# EAGLE schematic 2022_Tennessee_Competition (EAGLE 9.6.2)
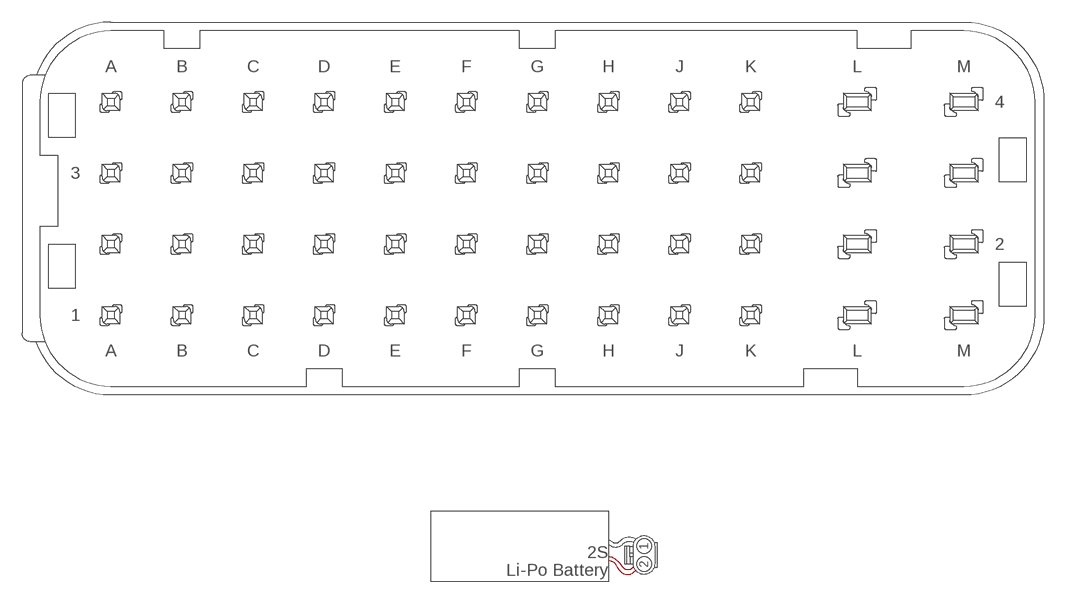
[diagram p0: schematic, sheet 1, part 1 of 2]
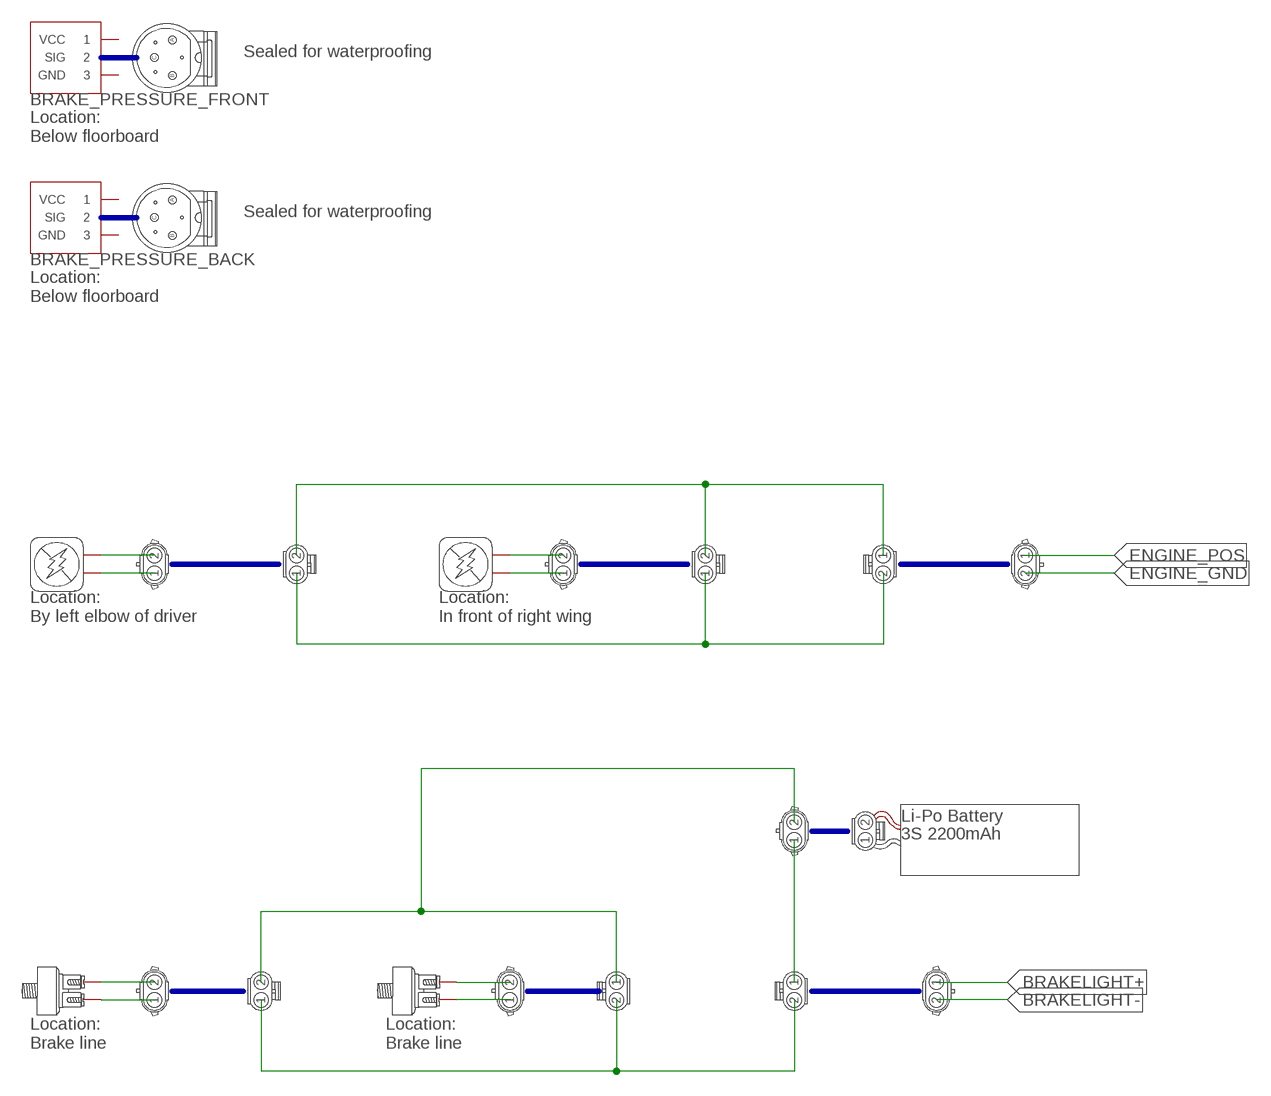
[diagram p1: schematic, sheet 1, part 2 of 2]

## Parts
BRAKE_PRESSURE_BACK  SENSOR_1X3  [PINS_3]
BRAKE_PRESSURE_FRONT  SENSOR_1X3  [PINS_3]
U$2  CMC_48PIN_PLUG_PCB  [PINS_49]
U$4  SKIDOO_KILLSWITCH  [PINS_3]
U$5  WEATHERPACK_1X2_MALE  [PINS_3]
U$6  WEATHERPACK_1X2_FEMALE  [PINS_3]
U$7  WEATHERPACK_1X2_MALE  [PINS_3]
U$8  WEATHERPACK_1X2_MALE  [PINS_3]
U$9  SKIDOO_KILLSWITCH  [PINS_3]
U$10  WEATHERPACK_1X2_FEMALE  [PINS_3]
U$11  WEATHERPACK_1X2_FEMALE  [PINS_3]
U$12  BRAKELIGHT_SWITCH_HYDRAULIC  [PINS_3]
U$13  WEATHERPACK_1X2_MALE  [PINS_3]
U$15  WEATHERPACK_1X2_FEMALE  [PINS_3]
U$16  WEATHERPACK_1X2_MALE  [PINS_3]
U$17  WEATHERPACK_1X2_MALE  [PINS_3]
U$18  BRAKELIGHT_SWITCH_HYDRAULIC  [PINS_3]
U$19  WEATHERPACK_1X2_FEMALE  [PINS_3]
U$20  WEATHERPACK_1X2_FEMALE  [PINS_3]
U$29  3S 2200mAh  LIPO_BATT  [PINS_200]
U$31  2S  LIPO_BATT  [PINS_200]
U$32  WEATHERPACK_1X2_MALE  [PINS_3]
U$47  METRIPACK_3PIN_FEMALE  [PINS_3]
U$48  METRIPACK_3PIN_FEMALE  [PINS_3]

## Nets
BRAKELIGHT+: U$16.P$2
BRAKELIGHT-: U$16.P$1
ENGINE_GND: U$7.P$1
ENGINE_POS: U$7.P$2
N$1: U$4.P$2 U$5.P$1
N$2: U$4.P$1 U$5.P$2
N$3: U$8.P$1 U$9.P$2
N$4: U$8.P$2 U$9.P$1
N$5: U$12.P$2 U$17.P$2
N$6: U$12.P$1 U$17.P$1
N$7: U$13.P$1 U$18.P$1
N$8: U$13.P$2 U$18.P$2
N$11: U$6.P$2 U$10.P$2 U$11.P$1
N$13: U$6.P$1 U$10.P$1 U$11.P$2
N$20: U$15.P$1 U$19.P$2 U$32.P$1
N$21: U$15.P$2 U$19.P$1 U$20.P$2
N$40: U$20.P$1 U$32.P$2
Unconnected: BRAKE_PRESSURE_BACK.P$1 BRAKE_PRESSURE_BACK.P$2 BRAKE_PRESSURE_BACK.P$3 BRAKE_PRESSURE_FRONT.P$1 BRAKE_PRESSURE_FRONT.P$2 BRAKE_PRESSURE_FRONT.P$3 U$2.P$1(A1) U$2.P$2(A2) U$2.P$3(A3) U$2.P$4(A4) U$2.P$5(B1) U$2.P$6(B2) U$2.P$7(B3) U$2.P$8(B4) U$2.P$9(C1) U$2.P$10(C2) U$2.P$11(C3) U$2.P$12(C4) U$2.P$13(D1) U$2.P$14(D2) U$2.P$15(D3) U$2.P$16(D4) U$2.P$17(E1) U$2.P$18(E2) U$2.P$19(E3) U$2.P$20(E4) U$2.P$21(F1) U$2.P$22(F2) U$2.P$23(F3) U$2.P$24(F4) U$2.P$25(G1) U$2.P$26(G2) U$2.P$27(G3) U$2.P$28(G4) U$2.P$29(H1) U$2.P$30(H2) U$2.P$31(H3) U$2.P$32(H4) U$2.P$33(J1) U$2.P$34(J2) U$2.P$35(J3) U$2.P$36(J4) U$2.P$37(K1) U$2.P$38(K2) U$2.P$39(K3) U$2.P$40(K4) U$29.P$1 U$29.P$2 U$31.P$1 U$31.P$2 U$47.P$1 U$47.P$2 U$47.P$3 U$48.P$1 U$48.P$2 U$48.P$3

## Buses
B$8
B$9
B$10
B$11
B$12
B$2
B$3
B$23

## Notes on the sheet
- Sealed for waterproofing
- Location:
  Below floorboard
- Sealed for waterproofing
- Location:
  Below floorboard
- Location:
  By left elbow of driver
- Location:
  In front of right wing
- Location:
  Brake line
- Location:
  Brake line

## Power pins joined to a net without a drawn wire
L1: U$2.P$41(L1)
L2: U$2.P$42(L2)
L3: U$2.P$43(L3)
L4: U$2.P$44(L4)
M1: U$2.P$45(M1)
M2: U$2.P$46(M2)
M3: U$2.P$47(M3)
M4: U$2.P$48(M4)

## Library data of the parts
BRAKE_PRESSURE_BACK BRAKE_PRESSURE_FRONT = wiring:SENSOR_1X3
U$2 = wiring:CMC_48PIN_PLUG_PCB: "Description: 48 Pin CMC plug connector (PCB through-hole) (40 signal 8 power) Manufacturer Part Number: 366380003 Manufacturer: Molex Vendor: Digikey Rows: 4 Pins: 48 Crimp Type: Male Waterproof: Yes Item URL: https://www.digikey.com/en/products/detail/molex/0366380003/2523207?s=N4IgTCBcDaIMwDYFwBwAYNxAXQL5A"
U$4 U$9 = wiring:SKIDOO_KILLSWITCH
U$5 U$7 U$8 U$13 U$16 U$17 U$32 = wiring:WEATHERPACK_1X2_MALE: "Description: 2-pin Weather-Pack male connector Manufacturer Part Number: 12010973 Manufacturer: Aptiv Vendor: Waytek Rows: 1 Pins: 2 Crimp Type: Male Waterproof: Yes Item URL: https://www.waytekwire.com/item/38042/Aptiv-12010973-Male-2-Contact-Shroud-Half/"
U$6 U$10 U$11 U$15 U$19 U$20 = wiring:WEATHERPACK_1X2_FEMALE: "Description: 2-pin Weather-Pack female connector Manufacturer Part Number: 12015792 Manufacturer: Aptiv Vendor: Waytek Rows: 1 Pins: 2 Crimp Type: Female Waterproof: Yes Item URL: https://www.waytekwire.com/item/38043/Aptiv-12015792-Female-2-Contact-Tower-Half-Body/"
U$12 U$18 = wiring:BRAKELIGHT_SWITCH_HYDRAULIC
U$29 U$31 = wiring:LIPO_BATT
U$47 U$48 = wiring:METRIPACK_3PIN_FEMALE